# EAGLE schematic AnalogOutputModule_8ch (EAGLE 7.7.0)
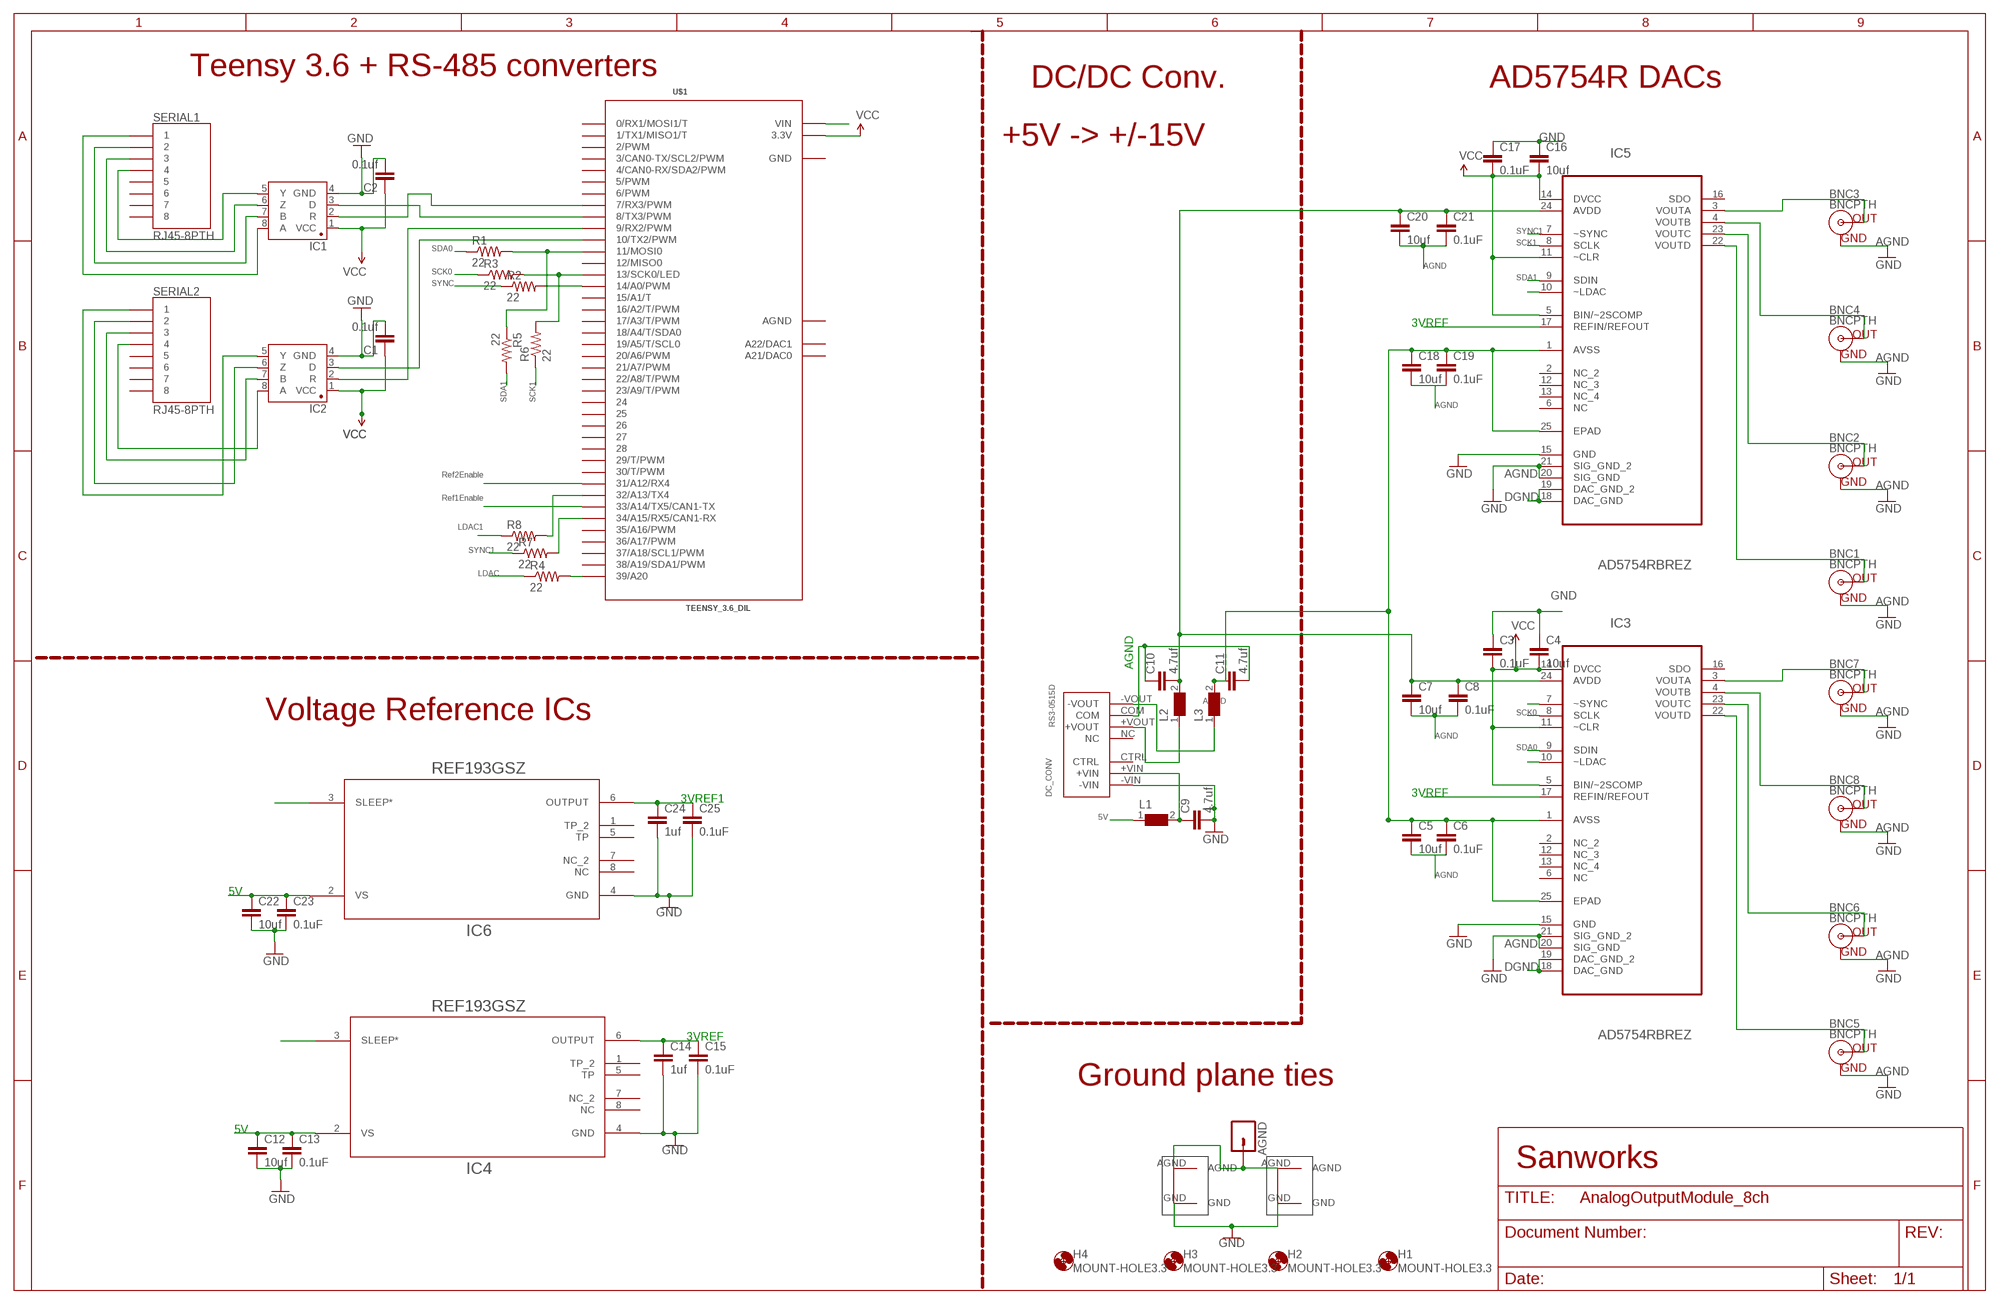
[diagram p0: schematic, sheet 1]

## Parts
AGND  M01PTH  [1X01]
BNC1  BNCPTH  [BNC]
BNC2  BNCPTH  [BNC]
BNC3  BNCPTH  [BNC]
BNC4  BNCPTH  [BNC]
BNC5  BNCPTH  [BNC]
BNC6  BNCPTH  [BNC]
BNC7  BNCPTH  [BNC]
BNC8  BNCPTH  [BNC]
C1  0.1uf  CAP1206  [1206@1]
C2  0.1uf  CAP1206  [1206@1]
C3  0.1uF  1.0UF-0805-25V-10%  [0805]
C4  10uf  CAP1206  [1206@1]
C5  10uf  CAP1206  [1206@1]
C6  0.1uF  1.0UF-0805-25V-10%  [0805]
C7  10uf  CAP1206  [1206@1]
C8  0.1uF  1.0UF-0805-25V-10%  [0805]
C9  4.7uf  CAP1206  [1206@1]
C10  4.7uf  CAP1206  [1206@1]
C11  4.7uf  CAP1206  [1206@1]
C12  10uf  CAP1206  [1206@1]
C13  0.1uF  1.0UF-0805-25V-10%  [0805]
C14  1uf  CAP1206  [1206@1]
C15  0.1uF  1.0UF-0805-25V-10%  [0805]
C16  10uf  CAP1206  [1206@1]
C17  0.1uF  1.0UF-0805-25V-10%  [0805]
C18  10uf  CAP1206  [1206@1]
C19  0.1uF  1.0UF-0805-25V-10%  [0805]
C20  10uf  CAP1206  [1206@1]
C21  0.1uF  1.0UF-0805-25V-10%  [0805]
C22  10uf  CAP1206  [1206@1]
C23  0.1uF  1.0UF-0805-25V-10%  [0805]
C24  1uf  CAP1206  [1206@1]
C25  0.1uF  1.0UF-0805-25V-10%  [0805]
DC_CONV  RS3-0515D  [RS3-0515D]
H1  MOUNT-HOLE3.3  [3,3]
H2  MOUNT-HOLE3.3  [3,3]
H3  MOUNT-HOLE3.3  [3,3]
H4  MOUNT-HOLE3.3  [3,3]
IC1  SN65HVD31DR  [SO08]
IC2  SN65HVD31DR  [SO08]
IC3  AD5754RBREZ  [SOP65P640X120-25N]
IC4  REF193GSZ  [R_8]
IC5  AD5754RBREZ  [SOP65P640X120-25N]
IC6  REF193GSZ  [R_8]
L1  WE-CBF-742792118_1206  [1206]
L2  WE-CBF-742792118_1206  [1206]
L3  WE-CBF-742792118_1206  [1206]
R1  22  RESISTOR1206  [1206]
R2  22  RESISTOR1206  [1206]
R3  22  RESISTOR1206  [1206]
R4  22  RESISTOR1206  [1206]
R5  22  RESISTOR1206  [1206]
R6  22  RESISTOR1206  [1206]
R7  22  RESISTOR1206  [1206]
R8  22  RESISTOR1206  [1206]
SERIAL1  RJ45-8PTH  [RJ45-8]
SERIAL2  RJ45-8PTH  [RJ45-8]
U$1  TEENSY_3.6_DIL  [TEENSY_3.6_DIL]
U$2  GNDPLANESHRT  [GNDPLANESHRT]
U$6  GNDPLANESHRT  [GNDPLANESHRT]

## Nets
3VREF: C14.1 C15.1 IC3.17(REFIN/REFOUT) IC4.6(OUTPUT)
3VREF1: C24.1 C25.1 IC5.17(REFIN/REFOUT) IC6.6(OUTPUT)
5V: C3.2 C4.2 C12.1 C13.1 C16.2 C17.2 C22.1 C23.1 IC3.5(BIN/~2SCOMP) IC3.11(~CLR) IC3.14(DVCC) IC4.2(VS) IC5.5(BIN/~2SCOMP) IC5.11(~CLR) IC5.14(DVCC) IC6.2(VS) L1.1 U$1.VIN ; supply symbol labelled VCC
AGND: AGND.1 BNC1.GND BNC2.GND BNC3.GND BNC4.GND BNC5.GND BNC6.GND BNC7.GND BNC8.GND C5.2 C6.2 C7.2 C8.2 C10.1 C11.2 C18.2 C19.2 C20.2 C21.2 DC_CONV.COM IC3.18(DAC_GND) IC3.19(DAC_GND_2) IC3.20(SIG_GND) IC3.21(SIG_GND_2) IC5.18(DAC_GND) IC5.19(DAC_GND_2) IC5.20(SIG_GND) IC5.21(SIG_GND_2) U$2.AGND U$6.AGND ; supply symbol labelled GND
GND: C1.2 C2.2 C3.1 C4.1 C9.2 C12.2 C13.2 C14.2 C15.2 C16.1 C17.1 C22.2 C23.2 C24.2 C25.2 DC_CONV.-VIN IC1.4(GND) IC2.4(GND) IC3.15(GND) IC4.4(GND) IC5.15(GND) IC6.4(GND) U$2.GND U$6.GND
LDAC: IC3.10(~LDAC) R4.1
LDAC1: IC5.10(~LDAC) R8.1
N$1: IC1.3(D) U$1.8(8/TX3/PWM)
N$2: IC1.2(R) U$1.7(7/RX3/PWM)
N$3: IC2.8(A) SERIAL2.4
N$4: IC2.7(B) SERIAL2.3
N$5: IC2.6(Z) SERIAL2.2
N$6: IC2.5(Y) SERIAL2.1
N$7: IC2.3(D) U$1.10(10/TX2/PWM)
N$8: IC2.2(R) U$1.9(9/RX2/PWM)
N$9: BNC7.S(OUT) IC3.3(VOUTA)
N$10: BNC8.S(OUT) IC3.4(VOUTB)
N$11: BNC6.S(OUT) IC3.23(VOUTC)
N$12: BNC5.S(OUT) IC3.22(VOUTD)
N$13: R1.2 R5.1 U$1.11(11/MOSI0)
N$14: R3.2 R6.2 U$1.13(13/SCK0/LED)
N$15: DC_CONV.-VOUT L3.1
N$16: DC_CONV.+VOUT L2.1
N$17: R2.2 U$1.14/A0(14/A0/PWM)
N$18: R4.2 U$1.39/A20
N$19: IC1.8(A) SERIAL1.1
N$21: IC1.7(B) SERIAL1.2
N$22: IC1.6(Z) SERIAL1.3
N$23: IC1.5(Y) SERIAL1.4
N$24: BNC3.S(OUT) IC5.3(VOUTA)
N$25: BNC4.S(OUT) IC5.4(VOUTB)
N$26: BNC2.S(OUT) IC5.23(VOUTC)
N$27: BNC1.S(OUT) IC5.22(VOUTD)
N$28: R7.2 U$1.34/A15(34/A15/RX5/CAN1-RX)
N$30: R8.2 U$1.32/A13(32/A13/TX4)
N$41: C9.1 DC_CONV.+VIN L1.2
REF1ENABLE: IC4.3(SLEEP*) U$1.33/A14(33/A14/TX5/CAN1-TX)
REF2ENABLE: IC6.3(SLEEP*) U$1.31/A12(31/A12/RX4)
SCK0: IC3.8(SCLK) R3.1
SCK1: IC5.8(SCLK) R6.1
SDA0: IC3.9(SDIN) R1.1
SDA1: IC5.9(SDIN) R5.2
SYNC: IC3.7(~SYNC) R2.1
SYNC1: IC5.7(~SYNC) R7.1
VCC: C1.1 C2.1 IC1.1(VCC) IC2.1(VCC) U$1.3.3V U$1.3.3V3(3.3V)
VDD1: C7.1 C8.1 C10.2 C20.1 C21.1 IC3.24(AVDD) IC5.24(AVDD) L2.2
VSS1: C5.1 C6.1 C11.1 C18.1 C19.1 IC3.1(AVSS) IC3.25(EPAD) IC5.1(AVSS) IC5.25(EPAD) L3.2
Unconnected: DC_CONV.CTRL DC_CONV.NC IC3.2(NC_2) IC3.6(NC) IC3.12(NC_3) IC3.13(NC_4) IC3.16(SDO) IC4.1(TP_2) IC4.5(TP) IC4.7(NC_2) IC4.8(NC) IC5.2(NC_2) IC5.6(NC) IC5.12(NC_3) IC5.13(NC_4) IC5.16(SDO) IC6.1(TP_2) IC6.5(TP) IC6.7(NC_2) IC6.8(NC) SERIAL1.5 SERIAL1.6 SERIAL1.7 SERIAL1.8 SERIAL2.5 SERIAL2.6 SERIAL2.7 SERIAL2.8 U$1.0(0/RX1/MOSI1/T) U$1.1(1/TX1/MISO1/T) U$1.2(2/PWM) U$1.3(3/CAN0-TX/SCL2/PWM) U$1.4(4/CAN0-RX/SDA2/PWM) U$1.5(5/PWM) U$1.6(6/PWM) U$1.12(12/MISO0) U$1.15/A1(15/A1/T) U$1.16/A2(16/A2/T/PWM) U$1.17/A3(17/A3/T/PWM) U$1.18/A4(18/A4/T/SDA0) U$1.19/A5(19/A5/T/SCL0) U$1.20/A6(20/A6/PWM) U$1.21/A7(21/A7/PWM) U$1.22/A8(22/A8/T/PWM) U$1.23/A9(23/A9/T/PWM) U$1.24 U$1.25 U$1.26 U$1.27 U$1.28 U$1.29(29/T/PWM) U$1.30(30/T/PWM) U$1.35/A16(35/A16/PWM) U$1.36/A17(36/A17/PWM) U$1.37/A18(37/A18/SCL1/PWM) U$1.38/A19(38/A19/SDA1/PWM) U$1.A21(A21/DAC0) U$1.A22(A22/DAC1)

## Notes on the sheet
- Teensy 3.6 + RS-485 converters
- DC/DC Conv. | AD5754R DACs
- GND
- +5V -> +/-15V
- SYNC1
- SCK1 | AGND
- SDA0
- AGND
- SCK0
- SDA1
- SYNC
- 3VREF
- AGND
- SDA1 | SCK1
- AGND
- Ref2Enable
- AGND
- AGND
- Ref1Enable
- DGND
- LDAC1
- SYNC1
- LDAC
- GND
- AGND
- AGND
- AGND
- SCK0 | AGND
- Voltage Reference ICs
- AGND
- SDA0
- 3VREF
- 3VREF1
- 5V
- AGND
- AGND
- 5V
- AGND
- AGND
- DGND
- 3VREF
- AGND
- Ground plane ties
- 5V
- Sanworks

## Power pins joined to a net without a drawn wire
AGND: U$1.AGND
GND: U$1.GND U$1.GND1(GND)

## Library data of the parts
AGND = SparkFun-Connectors:M01: Header 1 Standard 1-pin 0.1" header. Use with straight break away headers (SKU : PRT-00116), right angle break away headers (PRT-00553), swiss pins (PRT-00743), machine pins (PRT-00117), and female headers (PRT-00115).
BNC1-BNC8 = SparkFun-Connectors:BNC: BNC Right Angle Connector Mouser Part# 5227161 SparkFun Products: BNC Connector - Right Angle <https://www.sparkfun.com/products/10550>; PROD_ID: LPA-12729; SF_ID: PRT-10550
C1 C2 C4 C5 C7 C9-C12 C14 C16 C18 C20 C22 C24 = SparkFun-Capacitors:CAP: Capacitor Standard 0603 ceramic capacitor, and 0.1" leaded capacitor.
C3 C6 C8 C13 C15 C17 C19 C21 C23 C25 = SparkFun-Capacitors:1.0UF: 1µF ceramic capacitors A capacitor is a passive two-terminal electrical component used to store electrical energy temporarily in an electric field.; PROD_ID: CAP-08064; VALUE: 1.0uF
DC_CONV = JoshParts10:RS3-0515D
H1-H4 = holes:MOUNT-HOLE: MOUNTING HOLE with drill center marker
IC1 IC2 = Joshparts4:SN65HVD31DR: A placeholder for generic narrow & wide SOIC8 foorptints - used on the DIP adapter board.
IC3 IC5 = Analog Devices_By_element14_Batch_1:AD5754RBREZ: DAC; MPN: AD5754RBREZ; OC_FARNELL: 1786050; OC_NEWARK: 51P3755; PACKAGE: TSSOP-24; SUPPLIER: Analog Devices
IC4 IC6 = REF193:REF193GSZ; MANUFACTURER_PART_NUMBER: REF193GSZ; VENDOR: Vendor
L1-L3 = WE-CBF:WE-CBF: SMD EMI Suppression Ferrite Beads WE-CBF - Excellent anti-EMI properties - Low DC-restistance - Impedances till 3000 ohms - Rated current up to 6 A -- Reliable Ni-Sn electrodes -- Perfect as data lined filter and for uncoupling of distribution voltage; MPN: 742792118; OC_FARNELL: 1800374; OC_NEWARK: 78R5648; PACKAGE: IND-1206; SUPPLIER: Wuerth Elektronik
R1-R8 = SparkFun-Resistors:RESISTOR: Resistor Basic schematic elements and footprints for 0603, 1206, and PTH resistors.
SERIAL1 SERIAL2 = SparkFun:RJ45-8: RJ45 Jack Simple RJ45, 8-pin connection - connector for common Cat5, Cat5e, and Cat6 Ethernet cables. Footprint not yet proven in production. Connector sku is PRT-00643; Breakout PCB sku is BOB-00716.
U$1 = Teensy_3_and_LC_Series_Boards_v1.4:TEENSY_3.6_DIL: Teensy 3.6 DIL Package
U$2 U$6 = Joshparts2:GNDPLANESHRT

## Net classes
0 default: width 0.203 mm